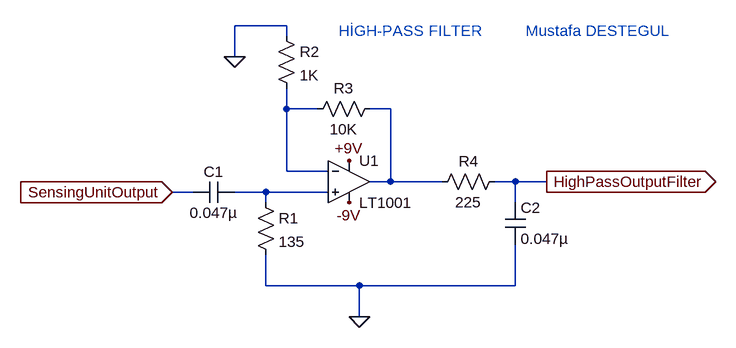
[diagram p0: schematic Draft1.asc]
Draft1.asc, the LTspice schematic file:
Version 4
SHEET 1 960 680
WIRE 256 -112 176 -112
WIRE 256 -96 256 -112
WIRE 176 -64 176 -112
WIRE 256 16 256 -16
WIRE 304 16 256 16
WIRE 416 16 384 16
WIRE 256 112 256 16
WIRE 320 112 256 112
WIRE 416 128 416 16
WIRE 416 128 384 128
WIRE 496 128 416 128
WIRE 608 128 576 128
WIRE 656 128 608 128
WIRE 112 144 80 144
WIRE 224 144 176 144
WIRE 320 144 224 144
WIRE 224 160 224 144
WIRE 608 160 608 128
WIRE 224 288 224 240
WIRE 368 288 224 288
WIRE 608 288 608 224
WIRE 608 288 368 288
WIRE 368 336 368 288
FLAG 368 336 0
FLAG 176 -64 0
FLAG 352 96 +9V
FLAG 352 160 -9V
FLAG 80 144 SensingUnitOutput
IOPIN 80 144 In
FLAG 656 128 HighPassOutputFilter
IOPIN 656 128 Out
SYMBOL cap 176 128 R90
WINDOW 0 0 32 VBottom 2
WINDOW 3 32 32 VTop 2
SYMATTR InstName C1
SYMATTR Value 0.047µ
SYMBOL res 208 144 R0
SYMATTR InstName R1
SYMATTR Value 135
SYMBOL Opamps\\LT1001 352 64 R0
SYMATTR InstName U1
SYMBOL res 240 -112 R0
SYMATTR InstName R2
SYMATTR Value 1K
SYMBOL res 400 0 R90
WINDOW 0 0 56 VBottom 2
WINDOW 3 32 56 VTop 2
SYMATTR InstName R3
SYMATTR Value 10K
SYMBOL res 592 112 R90
WINDOW 0 0 56 VBottom 2
WINDOW 3 32 56 VTop 2
SYMATTR InstName R4
SYMATTR Value 225
SYMBOL cap 592 160 R0
SYMATTR InstName C2
SYMATTR Value 0.047µ
TEXT 336 -104 Left 2 ;HİGH-PASS FILTER
TEXT 624 -104 Left 2 ;Mustafa DESTEGUL

The netlist it stands for:
* Draft1.asc
C1 N003 SensingUnitOutput 0.047µ
R1 N003 0 135
XU1 N003 N001 +9V -9V N002 LT1001  ; pins In+ In- V+ V- OUT
R2 0 N001 1K
R3 N002 N001 10K
R4 HighPassOutputFilter N002 225
C2 HighPassOutputFilter 0 0.047µ
* HİGH-PASS FILTER
* Mustafa DESTEGUL
.lib LTC.lib
.backanno
.end